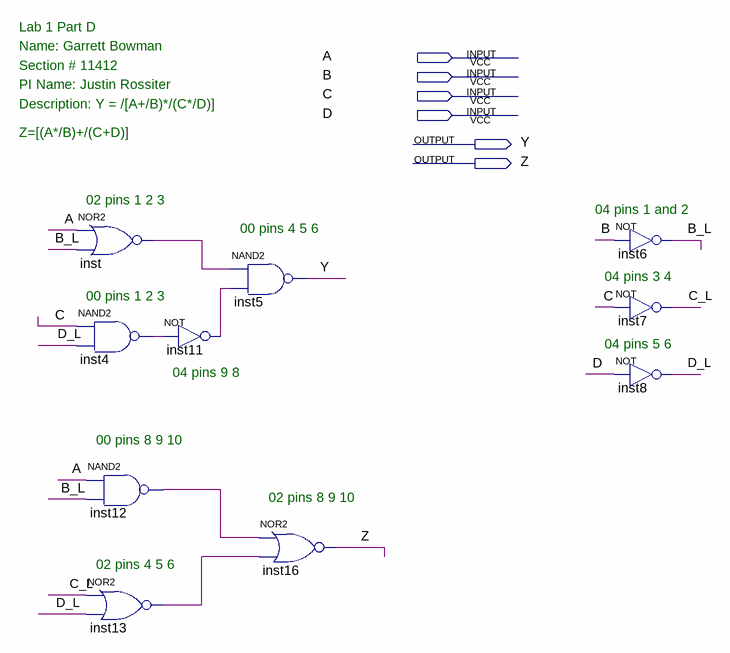
[diagram p0: schematic sheet]
// Quartus schematic Lab1d.bdf as structural Verilog: 10 symbols, 6 pins
module Lab1d (
  input  A,
  input  B,
  input  C,
  input  D,
  output Y,
  output Z
);

  wire B_L, C_L, D_L, inst4_out, inst11_out, inst12_out, inst13_out, inst_out;

  nor inst (inst_out, A, B_L);
  nand inst4 (inst4_out, C, D_L);
  nand inst12 (inst12_out, A, B_L);
  nor inst13 (inst13_out, C_L, D_L);
  not inst11 (inst11_out, inst4_out);
  nand inst5 (Y, inst_out, inst11_out);
  nor inst16 (Z, inst12_out, inst13_out);
  not inst6 (B_L, B);
  not inst7 (C_L, C);
  not inst8 (D_L, D);

  // Notes on the sheet:
  //   Lab 1 Part D
  //   Name: Garrett Bowman
  //   Section # 11412
  //   PI Name: Justin Rossiter
  //   Description: Y = /[A+/B)*/(C*/D)]
  //   Z=[(A*/B)+/(C+D)]
  //   02 pins 1 2 3
  //   04 pins 1 and 2
  //   00 pins 4 5 6
  //   04 pins 3 4
  //   00 pins 1 2 3
  //   04 pins 5 6
  //   04 pins 9 8
  //   00 pins 8 9 10
  //   02 pins 8 9 10
  //   02 pins 4 5 6
endmodule
